# Altium schematic sheet BordBox.SchDoc
size A; SheetNumber: 5; SheetTotal: 6
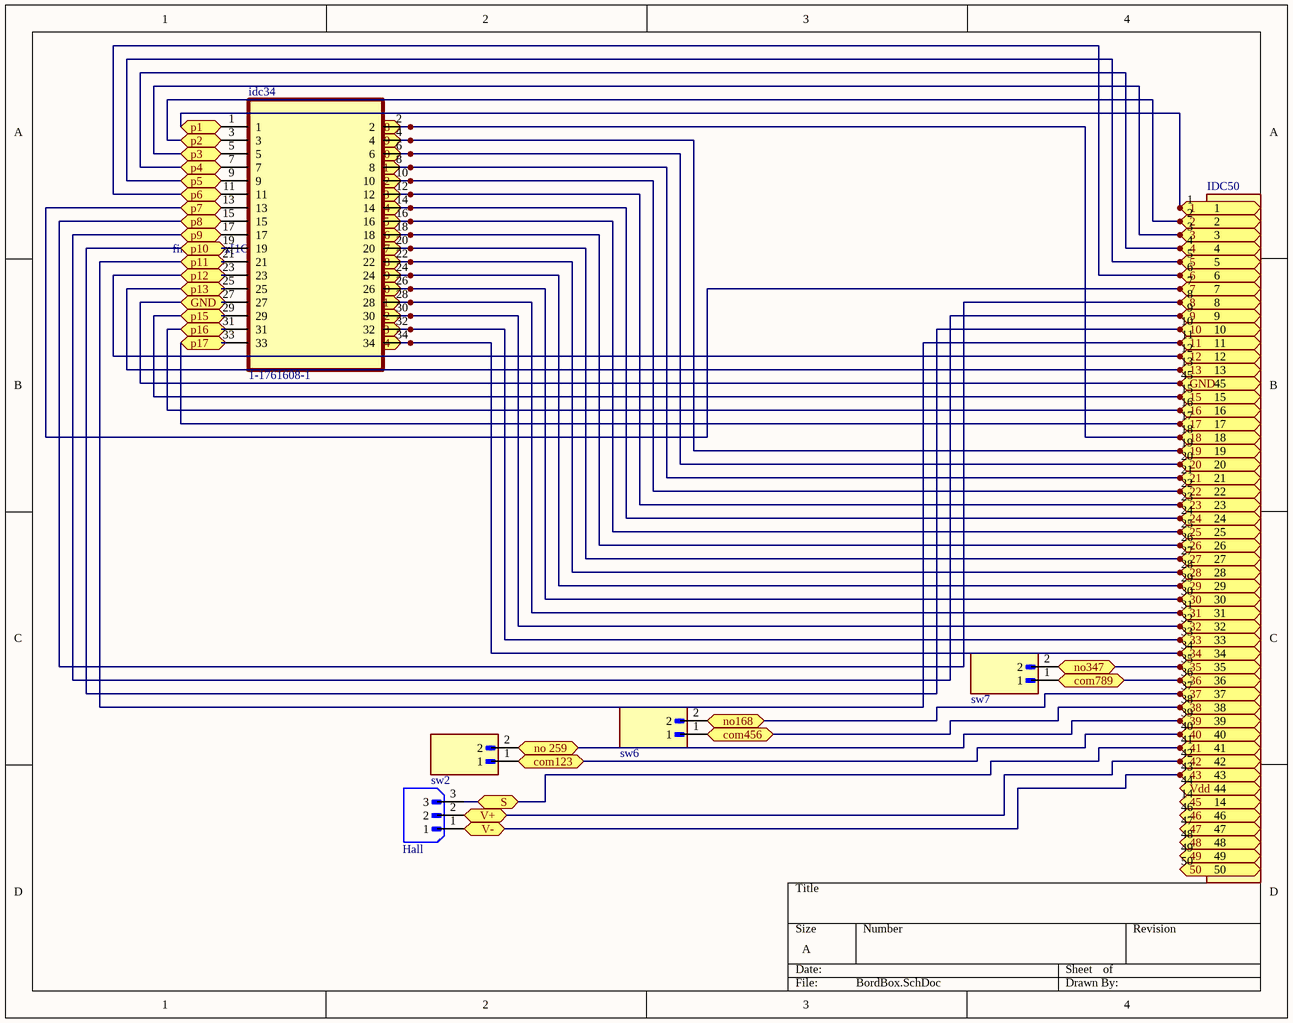
[diagram p0: BordBox.SchDoc]

## Parts
Hall  B3B-XH-A  [JST_B3B-XH-A]  (value not drawn)
idc34  1-1761608-1  [TYCO_1-1761608-1]
IDC50  1-1761686-5  [TE_1-1761686-5]  (value not drawn)
sw2  S2B-XH-A  [JST_S2B-XH-A]  (value not drawn)
sw6  S2B-XH-A  [JST_S2B-XH-A]  (value not drawn)
sw7  S2B-XH-A  [JST_S2B-XH-A]  (value not drawn)

## Ports
1 (bidir, see finetunebox[2A], Ctrl[4A]), 2 (bidir, see finetunebox[2A], Ctrl[4A]), 3 (bidir, see finetunebox[2A], Ctrl[4A]), 4 (bidir, see finetunebox[2A], Ctrl[4A]), 5 (bidir, see finetunebox[2A], Ctrl[4A]), 6 (bidir, see finetunebox[2A], Ctrl[4A]), 7 (bidir, see finetunebox[2A], Ctrl[4A]), 8 (bidir, see finetunebox[2A], Ctrl[4A]), 9 (bidir, see finetunebox[2A], Ctrl[4A]), 10 (bidir, see finetunebox[2A], Ctrl[4A]), 11 (bidir, see finetunebox[2A], Ctrl[4A]), 12 (bidir, see finetunebox[2A], Ctrl[4A]), 13 (bidir, see finetunebox[2A], Ctrl[4A]), 15 (bidir, see finetunebox[2B], Ctrl[4A]), 16 (bidir, see finetunebox[2B], Ctrl[4A]), 17 (bidir, see finetunebox[2B], Ctrl[4B]), 18 (bidir, see finetunebox[2B], Ctrl[4B]), 19 (bidir, see finetunebox[2B], Ctrl[4B]), 20 (bidir, see finetunebox[2B], Ctrl[4B]), 21 (bidir, see finetunebox[2B], Ctrl[4B]), 22 (bidir, see finetunebox[2B], Ctrl[4B]), 23 (bidir, see finetunebox[2B], Ctrl[4B]), 24 (bidir, see finetunebox[2B], Ctrl[4B]), 25 (bidir, see finetunebox[2B], Ctrl[4B]), 26 (bidir, see finetunebox[2B], Ctrl[4B]), 27 (bidir, see finetunebox[2B], Ctrl[4B]), 28 (bidir, see finetunebox[2B], Ctrl[4B]), 29 (bidir, see finetunebox[2B], Ctrl[4B]), 30 (bidir, see finetunebox[2B], Ctrl[4B]), 31 (bidir, see finetunebox[2B], Ctrl[4B]), 32 (bidir, see finetunebox[2B], Ctrl[4B]), 33 (bidir, see finetunebox[2C], Ctrl[4B]), 34 (bidir, see finetunebox[2C], Ctrl[4B]), 35 (bidir, see finetunebox[2C], Ctrl[3B]), 36 (bidir, see finetunebox[2C], Ctrl[3B]), 37 (bidir, see finetunebox[2C], Ctrl[2B]), 38 (bidir, see finetunebox[2C], Ctrl[2B]), 39 (bidir, see finetunebox[2C], Ctrl[2B]), 40 (bidir, see finetunebox[2C], Ctrl[2C]), 41 (bidir, see finetunebox[2C], Ctrl[2C]), 42 (bidir, see finetunebox[2C], Ctrl[2C]), 43 (bidir, see finetunebox[2C], Ctrl[2D]), 45 (bidir, see finetunebox[2C], Ctrl[3C]), 46 (bidir, see finetunebox[2C], Ctrl[3C]), 47 (bidir, see finetunebox[2C], Ctrl[3C]), 48 (bidir, see finetunebox[2C], Ctrl[3C]), 49 (bidir, see finetunebox[2C], Ctrl[3C]), 50 (bidir, see finetunebox[2C], Ctrl[3C]), com123 (bidir, see finetunebox[1A], parametrboard[3B]), com456 (bidir, see finetunebox[1A], parametrboard[2C]), com789 (bidir, see finetunebox[1A], parametrboard[2C]), GND (bidir, see finetunebox[1B], Ctrl[4A], parametrboard[1B]), no168 (bidir, see finetunebox[1A], parametrboard[2C]), no347 (bidir, see finetunebox[1A], parametrboard[2C]), no 259 (bidir, see finetunebox[1A], parametrboard[3B]), p1 (bidir, see finetunebox[1A], parametrboard[2A]), p2 (bidir, see finetunebox[1A], parametrboard[2A]), p3 (bidir, see finetunebox[1A], parametrboard[2A]), p4 (bidir, see finetunebox[1A], parametrboard[1A]), p5 (bidir, see finetunebox[1A], parametrboard[1A]), p6 (bidir, see finetunebox[1A], parametrboard[1A]), p7 (bidir, see finetunebox[1A], parametrboard[1A]), p8 (bidir, see finetunebox[1B], parametrboard[1A]), p9 (bidir, see finetunebox[1B], parametrboard[1A]), p10 (bidir, see finetunebox[1B], parametrboard[1A]), p11 (bidir, see finetunebox[1B], parametrboard[1A]), p12 (bidir, see finetunebox[1B], parametrboard[1A]), p13 (bidir, see finetunebox[1B], parametrboard[1A]), p15 (bidir, see finetunebox[1B], parametrboard[1B]), p16 (bidir, see finetunebox[1B], parametrboard[1B]), p17 (bidir, see finetunebox[1B], parametrboard[1B]), p18 (bidir, see finetunebox[1B], parametrboard[2A]), p19 (bidir, see finetunebox[1B], parametrboard[2A]), p20 (bidir, see finetunebox[1B], parametrboard[2A]), p21 (bidir, see finetunebox[1B], parametrboard[2A]), p22 (bidir, see finetunebox[1B], parametrboard[2A]), p23 (bidir, see finetunebox[1B], parametrboard[2A]), p24 (bidir, see finetunebox[1B], parametrboard[2A]), p25 (bidir, see finetunebox[1B], parametrboard[2A]), p26 (bidir, see finetunebox[1B], parametrboard[2A]), p27 (bidir, see finetunebox[1C], parametrboard[2A]), p28 (bidir, see finetunebox[1C], parametrboard[2A]), p29 (bidir, see finetunebox[1C], parametrboard[2A]), p30 (bidir, see finetunebox[1C], parametrboard[2A]), p31 (bidir, see finetunebox[1C], parametrboard[2B]), p32 (bidir, see finetunebox[1C], parametrboard[2B]), p33 (bidir, see finetunebox[1C], parametrboard[2B]), p34 (bidir, see finetunebox[1C], parametrboard[2B]), S (bidir, see finetunebox[1C], parametrboard[1B]), V+ (bidir, see finetunebox[1C], parametrboard[1B]), V- (bidir, see finetunebox[1C], parametrboard[1B]), Vdd (bidir, see finetunebox[2C], Ctrl[3C])

## Nets
1: idc34.1 IDC50.1 ; port p1, port 1
2: idc34.3 IDC50.2 ; port p2, port 2
3: idc34.5 IDC50.3 ; port p3, port 3
4: idc34.7 IDC50.4 ; port p4, port 4
5: idc34.9 IDC50.5 ; port p5, port 5
6: idc34.11 IDC50.6 ; port p6, port 6
7: idc34.13 IDC50.7 ; port p7, port 7
8: idc34.15 IDC50.8 ; port p8, port 8
9: idc34.17 IDC50.9 ; port p9, port 9
10: idc34.19 IDC50.10 ; port p10, port 10
11: idc34.21 IDC50.11 ; port p11, port 11
12: idc34.23 IDC50.12 ; port p12, port 12
13: idc34.25 IDC50.13 ; port p13, port 13
15: idc34.29 IDC50.15 ; port p15, port 15
16: idc34.31 IDC50.16 ; port p16, port 16
17: idc34.33 IDC50.17 ; port p17, port 17
18: idc34.2 IDC50.18 ; port p18, port 18
19: idc34.4 IDC50.19 ; port p19, port 19
20: idc34.6 IDC50.20 ; port p20, port 20
21: idc34.8 IDC50.21 ; port p21, port 21
22: idc34.10 IDC50.22 ; port p22, port 22
23: idc34.12 IDC50.23 ; port p23, port 23
24: idc34.14 IDC50.24 ; port p24, port 24
25: idc34.16 IDC50.25 ; port p25, port 25
26: idc34.18 IDC50.26 ; port p26, port 26
27: idc34.20 IDC50.27 ; port p27, port 27
28: idc34.22 IDC50.28 ; port p28, port 28
29: idc34.24 IDC50.29 ; port p29, port 29
30: idc34.26 IDC50.30 ; port p30, port 30
31: idc34.28 IDC50.31 ; port p31, port 31
32: idc34.30 IDC50.32 ; port p32, port 32
33: idc34.32 IDC50.33 ; port p33, port 33
34: idc34.34 IDC50.34 ; port p34, port 34
35: IDC50.35 sw7.2 ; port no347, port 35
36: IDC50.36 sw7.1 ; port com789, port 36
37: IDC50.37 sw6.2 ; port no168, port 37
38: IDC50.38 sw6.1 ; port com456, port 38
39: IDC50.39 sw2.2 ; port no 259, port 39
40: IDC50.40 sw2.1 ; port com123, port 40
41: Hall.3 IDC50.41 ; port S, port 41
42: Hall.2 IDC50.42 ; port V+, port 42
43: Hall.1 IDC50.43 ; port V-, port 43
45: IDC50.14 ; port 45
46: IDC50.46 ; port 46
47: IDC50.47 ; port 47
48: IDC50.48 ; port 48
49: IDC50.49 ; port 49
50: IDC50.50 ; port 50
GND: idc34.27 IDC50.45 ; port GND
Vdd: IDC50.44 ; port Vdd

## Library data of the parts
Hall = B3B-XH-A: Connector Header Through Hole 3 position 0.098 (2.50mm); MF: JST Sales; SnapEDA_Link: https://www.snapeda.com/parts/B3B-XH-A/JST+Sales+America+Inc./view-part/?ref=snap; Package: None; Value: *; MP: B3B-XH-A; Check_prices: https://www.snapeda.com/parts/B3B-XH-A/JST+Sales+America+Inc./view-part/?ref=eda
idc34 = 1-1761608-1: IDC LOW PRO HDR 34P VERT SHT L; MF: TE Connectivity; MP: 117616081; SnapEDA_Link: https://www.snapeda.com/parts/117616081/TE+Connectivity/view-part/?ref=snap; Package: None; Value: *; Check_prices: https://www.snapeda.com/parts/117616081/TE+Connectivity/view-part/?ref=eda
IDC50 = 1-1761686-5: Package: None; Price: None; Value: *; MP: 1-1761686-5; Availability: Unavailable
sw2 sw6 sw7 = S2B-XH-A: Package: None; Price: None; Value: *; MP: S2B-XH-A; Availability: Unavailable